# Altium schematic sheet 物联网温度实时监测设备.SchDoc
size A3
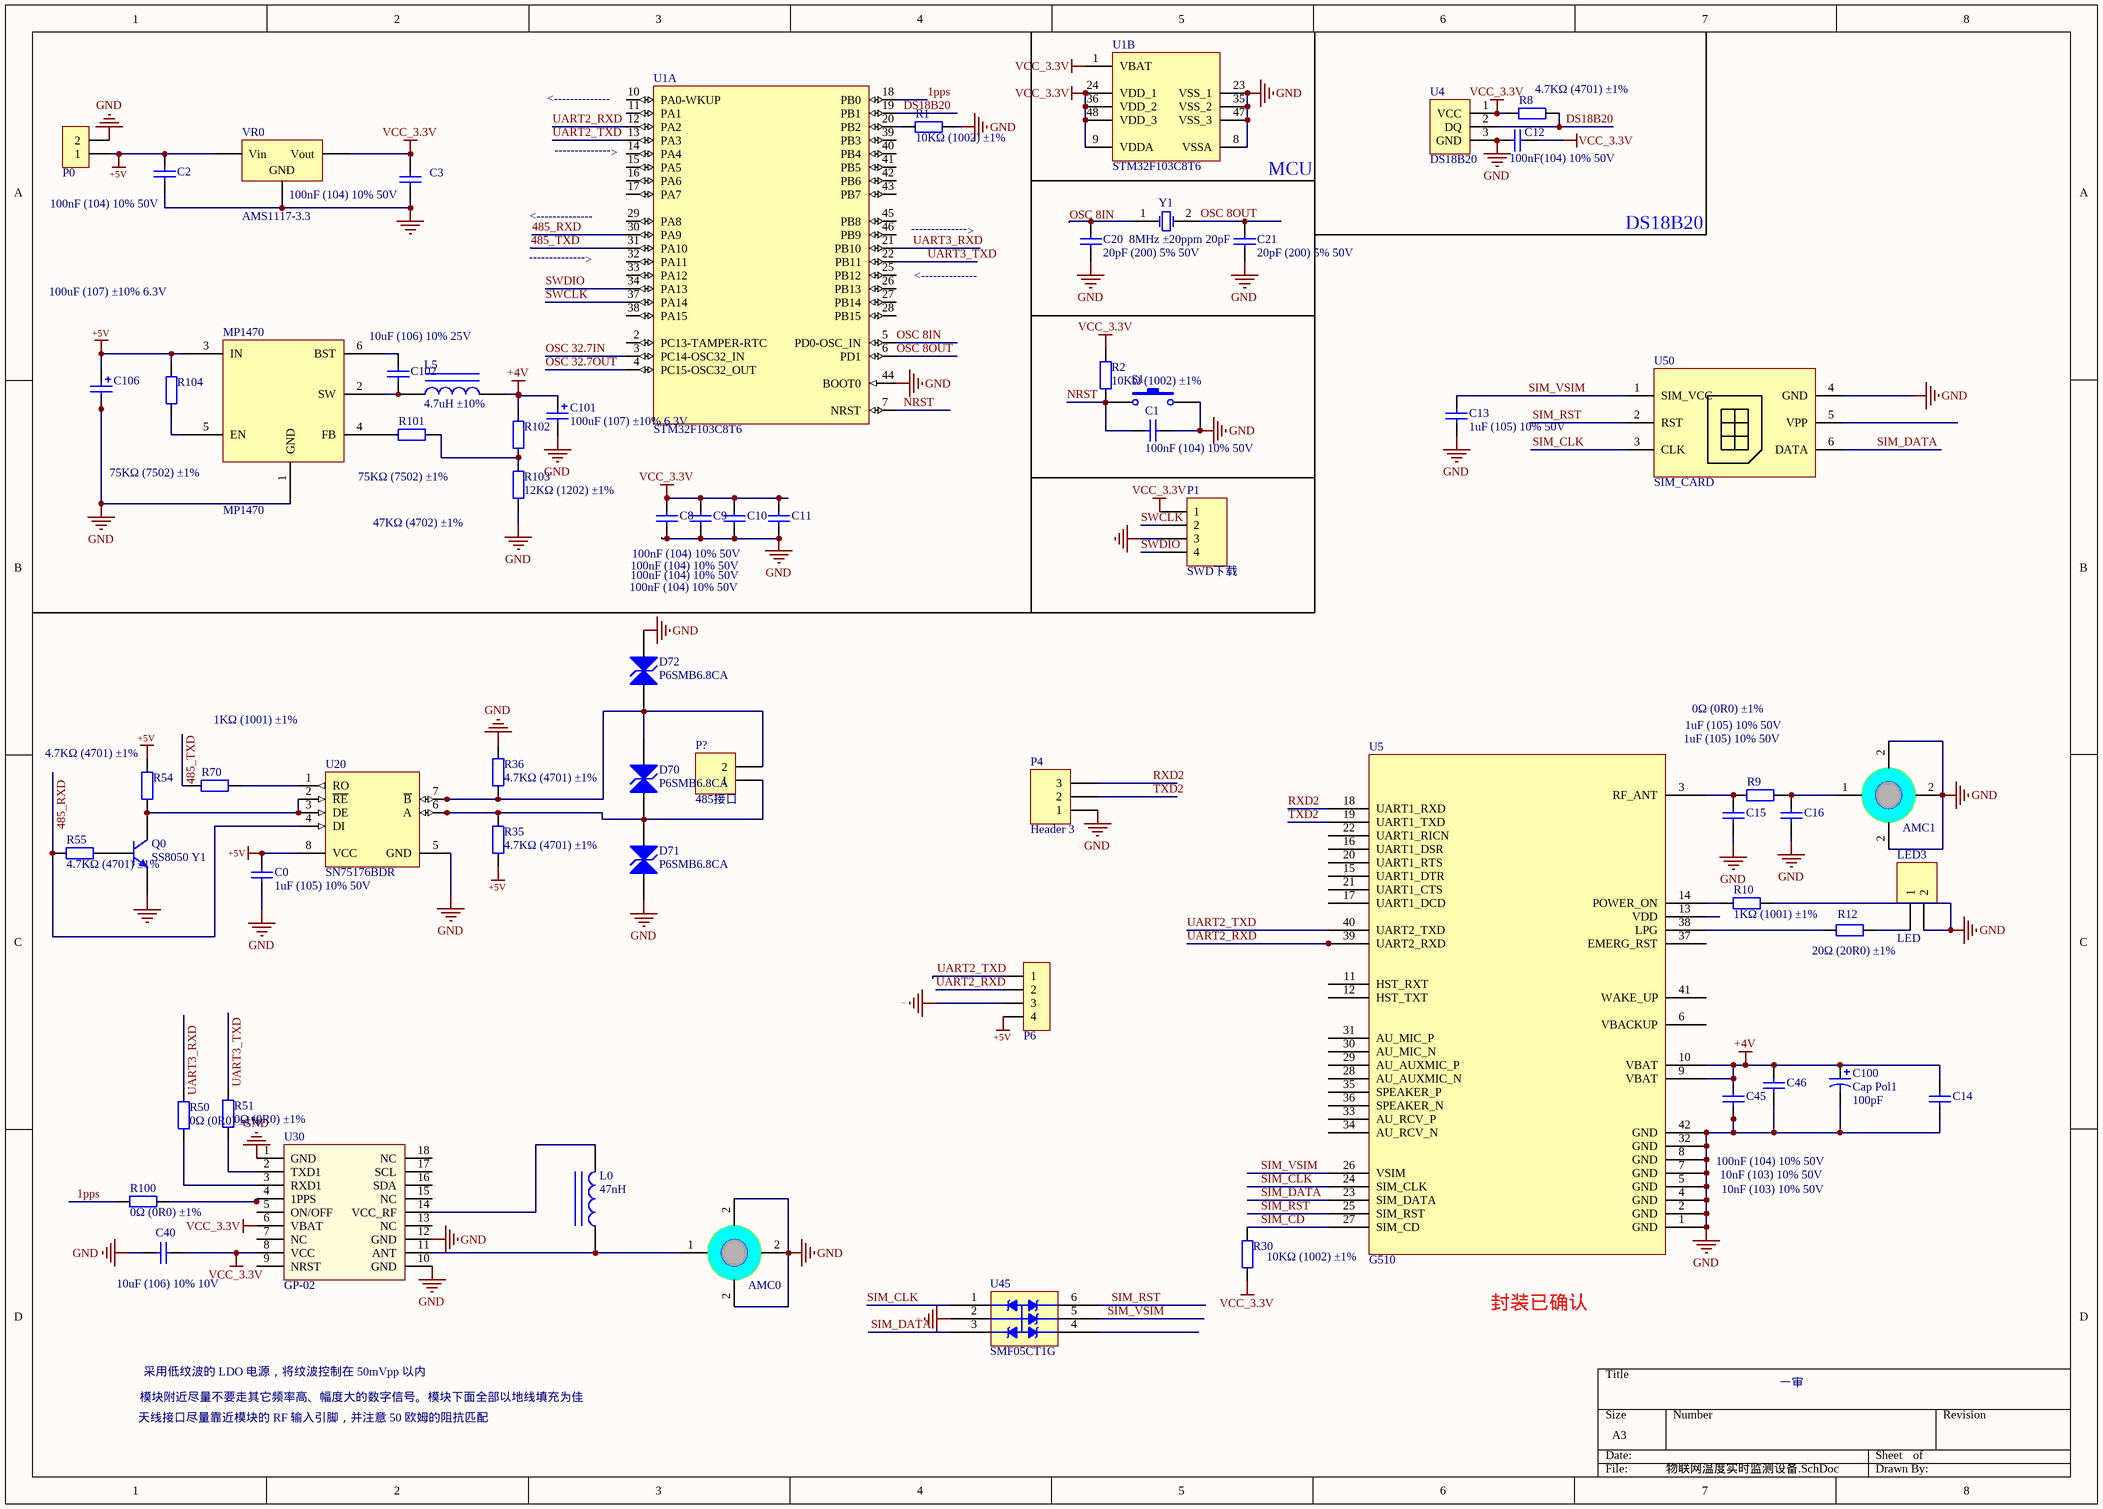
[diagram p0: 物联网温度实时监测设备.SchDoc]

## Parts
AMC0  Component_1  [IPEX]  (value not drawn)
AMC1  Component_1  [IPEX]  (value not drawn)
C0  1uF (105) 10% 50V  [0603_C]
C1  100nF (104) 10% 50V  [0603_C]
C2  100nF (104) 10% 50V  [0603_C]
C3  100nF (104) 10% 50V  [0603_C]
C8  100nF (104) 10% 50V  [0603_C]
C9  100nF (104) 10% 50V  [0603_C]
C10  100nF (104) 10% 50V  [0603_C]
C11  100nF (104) 10% 50V  [0603_C]
C12  100nF(104) 10% 50V  [CAPC_0805]
C13  1uF (105) 10% 50V  [0603_C]
C14  10nF (103) 10% 50V  [0603_C]
C15  1uF (105) 10% 50V  [0603_C]
C16  1uF (105) 10% 50V  [0603_C]
C20  20pF (200) 5% 50V  [0603_C]
C21  20pF (200) 5% 50V  [0603_C]
C40  10uF (106) 10% 10V  [0603_C]
C45  100nF (104) 10% 50V  [0603_C]
C46  10nF (103) 10% 50V  [0603_C]
C100  Cap Pol1  value 100pF  [C7361]
C101  100uF (107) ±10% 6.3V  [CASE-B_3528]
C102  10uF (106) 10% 25V  [0805_C]
C106  100uF (107) ±10% 6.3V  [CASE-B_3528]
D70  P6SMB6.8CA  [SMB(DO-214AA)_S1]
D71  P6SMB6.8CA  [SMB(DO-214AA)_S1]
D72  P6SMB6.8CA  [SMB(DO-214AA)_S1]
L0  47nH  [0603_L]
L5  4.7uH ±10%  [CD54NP]
LED3  LED  [LED_3MM]
MP1470  MP1470  [SOT-23-6M]
P0  HDR-1X2  [XH2.54-2]  (value not drawn)
P1  SWD下载  [Header 2.54X4]
P4  Header 3  [Header 2.54X3]
P6  ZH1.5-4P  [ZH1.5-4P]  (value not drawn)
P?  485接口  [2EDGK-2P]
Q0  SS8050 Y1  [SOT-23(SOT-23-3)]
R1  10KΩ (1002) ±1%  [0603_R]
R2  10KΩ (1002) ±1%  [0603_R]
R8  4.7KΩ (4701) ±1%  [0603_R]
R9  0Ω (0R0) ±1%  [0603_R]
R10  1KΩ (1001) ±1%  [0603_R]
R12  20Ω (20R0) ±1%  [0603_R]
R30  10KΩ (1002) ±1%  [0603_R]
R35  4.7KΩ (4701) ±1%  [0603_R]
R36  4.7KΩ (4701) ±1%  [0603_R]
R50  0Ω (0R0) ±1%  [0603_R]
R51  0Ω (0R0) ±1%  [0603_R]
R54  4.7KΩ (4701) ±1%  [0603_R]
R55  4.7KΩ (4701) ±1%  [0603_R]
R70  1KΩ (1001) ±1%  [0603_R]
R100  0Ω (0R0) ±1%  [0603_R]
R101  75KΩ (7502) ±1%  [0603_R]
R102  47KΩ (4702) ±1%  [0603_R]
R103  12KΩ (1202) ±1%  [0603_R]
R104  75KΩ (7502) ±1%  [0603_R]
S1  SW-PB  [KEY-SMD1]  (value not drawn)
U1  STM32F103C8T6  [LQFP_48_7X7]  (parts A,B of 2)
U4  DS18B20  [XH_2.54_3P]
U5  G510  [G510]
U20  SN75176BDR  [SOIC-8_150mil]
U30  GP-02  [GP-02]
U45  SMF05CT1G  [SC-70-6(SOT-363)]
U50  SIM_CARD  [SIM_MICRO_6P_F]
VR0  AMS1117-3.3  [SOT-223]
Y1  8MHz ±20ppm 20pF  [SMD-5032_2P]

## Nets
+4V: C14.2 C45.2 C46.2 C100.1 C101.1 L5.2 R102.2 U5.9(VBAT) U5.10(VBAT)
+5V: C0.2 C2.1 C106.1 MP1470.3(IN) P0.1 P6.4 R35.1 R54.2 R104.2 U20.8(VCC) VR0.3(Vin)
GND: AMC0.2(G) AMC1.2(G) C0.1 C1.1 C2.2 C3.1 C8.1 C9.1 C10.1 C11.1 C12.1 C13.1 C14.1 C15.1 C16.1 C20.1 C21.1 C40.2 C45.1 C46.1 C100.2 C101.2 C106.2 D71.1(A) D72.2(K) LED3.2 MP1470.1(GND) P0.2 P1.3 P4.1 P6.3 Q0.2(E) R1.2 R10.2 R36.2 R103.1 S1.2 U1.8(VSSA) U1.23(VSS_1) U1.35(VSS_2) U1.44(BOOT0) U1.47(VSS_3) U4.3(GND) U5.1(GND) U5.2(GND) U5.4(GND) U5.5(GND) U5.7(GND) U5.8(GND) U5.32(GND) U5.42(GND) U20.5(GND) U30.1(GND) U30.10(GND) U30.12(GND) U45.2 U50.4(GND) VR0.1(GND)
VCC_3.3V: C3.2 C8.2 C9.2 C10.2 C11.2 C12.2 C40.1 P1.1 R2.2 R8.1 R30.1 U1.1(VBAT) U1.9(VDDA) U1.24(VDD_1) U1.36(VDD_2) U1.48(VDD_3) U4.1(VCC) U30.6(VBAT) U30.8(VCC) VR0.2(Vout)
1pps: R100.2 U1.18(PB0)
485_RXD: R55.1 U1.30(PA9) U20.4(DI)
485_TXD: R70.1 U1.31(PA10)
DS18B20: R8.2 U1.19(PB1) U4.2(DQ)
NRST: C1.2 R2.1 S1.1 U1.7(NRST)
OSC 8IN: C20.2 U1.5(PD0-OSC_IN) Y1.1(OSC1)
OSC 8OUT: C21.2 U1.6(PD1) Y1.2(OSC2)
OSC 32.7IN: U1.3(PC14-OSC32_IN)
OSC 32.7OUT: U1.4(PC15-OSC32_OUT)
RXD2: P4.3 U5.18(UART1_RXD)
SIM_CD: R30.2 U5.27(SIM_CD)
SIM_CLK: U5.24(SIM_CLK) U45.1 U50.3(CLK)
SIM_DATA: U5.23(SIM_DATA) U45.3 U50.6(DATA)
SIM_RST: U5.25(SIM_RST) U45.6 U50.2(RST)
SIM_VSIM: C13.2 U5.26(VSIM) U45.5 U50.1(SIM_VCC)
SWCLK: P1.2 U1.37(PA14)
SWDIO: P1.4 U1.34(PA13)
TXD2: P4.2 U5.19(UART1_TXD)
UART2_RXD: P6.2 U1.12(PA2) U5.39(UART2_RXD)
UART2_TXD: P6.1 U1.13(PA3) U5.40(UART2_TXD)
UART3_RXD: R50.2 U1.21(PB10)
UART3_TXD: R51.2 U1.22(PB11)
NetAMC0_1: AMC0.1(S) L0.1 U30.11(ANT)
NetAMC1_1: AMC1.1(S) C16.2 R9.2
NetC15_2: C15.2 R9.1 U5.3(RF_ANT)
NetC102_1: C102.1 L5.1 MP1470.2(SW)
NetC102_2: C102.2 MP1470.6(BST)
NetD70_1: D70.1(A) D71.2(K) P?.1 R35.2 U20.6(A)
NetD70_2: D70.2(K) D72.1(A) P?.2 R36.1 U20.7(~{B})
NetL0_2: L0.2 U30.14(VCC_RF)
NetLED3_1: LED3.1 R12.2
NetMP1470_4: MP1470.4(FB) R101.1
NetMP1470_5: MP1470.5(EN) R104.1
NetQ0_1: Q0.1(B) R55.2
NetQ0_3: Q0.3(C) R54.1 U20.2(~{RE}) U20.3(DE)
NetR1_1: R1.1 U1.20(PB2)
NetR10_1: R10.1 U5.14(POWER_ON)
NetR12_1: R12.1 U5.38(LPG)
NetR50_1: R50.1 U30.3(RXD1)
NetR51_1: R51.1 U30.2(TXD1)
NetR70_2: R70.2 U20.1(RO)
NetR100_1: R100.1 U30.4(1PPS)
NetR101_2: R101.2 R102.1 R103.2

Not connected (* = marked no-connect by the designer): U1 2(PC13-TAMPER-RTC) 10(PA0-WKUP) 11(PA1) 14(PA4) 15(PA5) 16(PA6) 17(PA7) 25(PB12) 26(PB13) 27(PB14) 28(PB15) 29(PA8) 32(PA11) 33(PA12) 38(PA15) 39(PB3) 40(PB4) 41(PB5) 42(PB6) 43(PB7) 45(PB8) 46(PB9); U5 6(VBACKUP) 11(HST_RXT) 12(HST_TXT) 13(VDD) 15(UART1_DTR) 16(UART1_DSR) 17(UART1_DCD) 20(UART1_RTS) 21(UART1_CTS) 22(UART1_RICN) 28(AU_AUXMIC_N) 29(AU_AUXMIC_P) 30(AU_MIC_N) 31(AU_MIC_P) 33(AU_RCV_P) 34(AU_RCV_N) 35(SPEAKER_P) 36(SPEAKER_N) 37(EMERG_RST) 41(WAKE_UP); U30 5(ON/OFF) 7(NC) 9(NRST) 13(NC) 15(NC) 16(SDA) 17(SCL) 18(NC); U45 4; U50 5(VPP)

## Notes on the sheet
- (near U1) <--------------
- MCU
- <--------------
- DS18B20
- 封装已确认
- 采用低纹波的 LDO 电源，将纹波控制在 50mVpp 以内
- 一审
- 天线接口尽量靠近模块的 RF 输入引脚，并注意 50 欧姆的阻抗匹配
- 模块附近尽量不要走其它频率高、幅度大的数字信号。模块下面全部以地线填充为佳

## Library data of the parts
AMC0 AMC1 = Component_1_2
C0 C13 C15 C16 = 0603 1uF (105) 10% 50V: 贴片电容; ComponentLink1Description: 供应商链接; ComponentLink1URL: http://www.szlcsc.com/product/details_16531.html; Package: 0603; Supplier: LC; SuppliersPartNumber: C15849
C1-C3 C8-C11 C45 = 0603 100nF (104) 10% 50V: 贴片电容; ComponentLink1Description: 供应商链接; ComponentLink1URL: http://www.szlcsc.com/product/details_15331.html; Package: 0603; Supplier: LC; SuppliersPartNumber: C14663
C12 = 0805 100nF(104) 10% 50V: 贴片电容; ComponentLink1Description: 供应商链接; ComponentLink1URL: http://www.szlcsc.com/product/details_50686.html; Package: 0805; Supplier: LC; SuppliersPartNumber: C49678
C14 C46 = 0603 10nF (103) 10% 50V: 贴片电容; ComponentLink1Description: 供应商链接; ComponentLink1URL: http://www.szlcsc.com/product/details_58143.html; Package: 0603; Supplier: LC; SuppliersPartNumber: C57112
C20 C21 = 0603 20pF (200) 5% 50V: 贴片电容; ComponentLink1Description: 供应商链接; ComponentLink1URL: http://www.szlcsc.com/product/details_2000.html; Package: 0603; Supplier: LC; SuppliersPartNumber: C1648
C40 = 0603 10uF (106) 10% 10V: 贴片电容; ComponentLink1Description: 供应商链接; ComponentLink1URL: http://www.szlcsc.com/product/details_20411.html; Package: 0603; Supplier: LC; SuppliersPartNumber: C19702
C100 = Cap Pol1: Polarized Capacitor (Radial); Published: 8-Jun-2000; LatestRevisionDate: 17-Jul-2002; LatestRevisionNote: Re-released for DXP Platform.; PackageReference: RB7.6-15; Publisher: Altium Limited; PackageDescription: Polarized Capacitor (Radial); 2 Leads
C101 C106 = 3528 100uF (107) 10% 6.3V: 钽电容; ComponentLink1Description: 供应商链接; ComponentLink1URL: http://www.szlcsc.com/product/details_16815.html; Package: 3528; Supplier: LC; SuppliersPartNumber: C16133
C102 = 0805 10uF (106) 10% 25V: 贴片电容; ComponentLink1Description: 供应商链接; ComponentLink1URL: http://www.szlcsc.com/product/details_16532.html; Package: 0805; Supplier: LC; SuppliersPartNumber: C15850
D70-D72 = SMB/DO-214AA P6SMB6.8CA: TVS; ComponentLink1Description: 供应商链接; ComponentLink1URL: http://www.szlcsc.com/product/details_79530.html; Package: SMB/DO-214AA; Supplier: LC; SuppliersPartNumber: C78395
L0 = 0603 47nH: 贴片电感; ComponentLink1Description: 供应商链接; ComponentLink1URL: http://www.szlcsc.com/product/details_30437.html; Package: 0603; Supplier: LC; SuppliersPartNumber: C29683
L5 = 0603 4.7uH 10%: 贴片电感; ComponentLink1Description: 供应商链接; ComponentLink1URL: http://www.szlcsc.com/product/details_1386.html; Package: 0603; Supplier: LC; SuppliersPartNumber: C1034
LED3 P? = Header 2: Header, 2-Pin; LatestRevisionDate: 17-Jul-2002; LatestRevisionNote: Re-released for DXP Platform.; Publisher: Altium Limited
P0 = Header 2: 2P接插件; 版权归属: 源创客; BOM名称: 2P接插件; 学习资源: www.ooocke.com
P1 = Header 4: Header, 4-Pin; LatestRevisionDate: 17-Jul-2002; LatestRevisionNote: Re-released for DXP Platform.; Publisher: Altium Limited
P4 = Header 3: Header, 3-Pin; LatestRevisionDate: 17-Jul-2002; LatestRevisionNote: Re-released for DXP Platform.; Publisher: Altium Limited
P6 = Header 4: 4P接插件; 版权归属: 源创客; BOM名称: 4P接插件; 学习资源: www.ooocke.com
Q0 = SOT-23 SS8050 Y1: 三极管; ComponentLink1Description: 供应商链接; ComponentLink1URL: http://www.szlcsc.com/product/details_2507.html; Package: SOT-23; Supplier: LC; SuppliersPartNumber: C2150
R1 R2 R30 = 0603 10KΩ (1002) 1%: 贴片电阻; ComponentLink1Description: 供应商链接; ComponentLink1URL: http://www.szlcsc.com/product/details_26547.html; Package: 0603; Supplier: LC; SuppliersPartNumber: C25804
R8 R35 R36 R54 R55 = 0603 4.7KΩ (4701) 1%: 贴片电阻; ComponentLink1Description: 供应商链接; ComponentLink1URL: http://www.szlcsc.com/product/details_23889.html; Package: 0603; Supplier: LC; SuppliersPartNumber: C23162
R9 R50 R51 R100 = 0603 0Ω (0R0) 1%: 贴片电阻; ComponentLink1Description: 供应商链接; ComponentLink1URL: http://www.szlcsc.com/product/details_21903.html; Package: 0603; Supplier: LC; SuppliersPartNumber: C21189
R10 R70 = 0603 1KΩ (1001) 1%: 贴片电阻; ComponentLink1Description: 供应商链接; ComponentLink1URL: http://www.szlcsc.com/product/details_21904.html; Package: 0603; Supplier: LC; SuppliersPartNumber: C21190
R12 = 0603 20Ω (20R0) 1%: 贴片电阻; ComponentLink1Description: 供应商链接; ComponentLink1URL: http://www.szlcsc.com/product/details_23677.html; Package: 0603; Supplier: LC; SuppliersPartNumber: C22950
R101 R104 = 0603 75KΩ (7502) 1%: 贴片电阻; ComponentLink1Description: 供应商链接; ComponentLink1URL: http://www.szlcsc.com/product/details_23969.html; Package: 0603; Supplier: LC; SuppliersPartNumber: C23242
R102 = 0603 47KΩ (4702) 1%: 贴片电阻; ComponentLink1Description: 供应商链接; ComponentLink1URL: http://www.szlcsc.com/product/details_26562.html; Package: 0603; Supplier: LC; SuppliersPartNumber: C25819
R103 = 0603 12KΩ (1202) 1%: 贴片电阻; ComponentLink1Description: 供应商链接; ComponentLink1URL: http://www.szlcsc.com/product/details_23517.html; Package: 0603; Supplier: LC; SuppliersPartNumber: C22790
S1 = SW-PB_1: 微动开关; Published: 24-Mar-1999; LatestRevisionDate: 17-Jul-2002; LatestRevisionNote: Re-released for DXP Platform.; PackageReference: SPST-2; Publisher: Altium Limited
U1 = STM32F103C8T6: ARM; ComponentLink1Description: 供应商链接; ComponentLink1URL: http://www.szlcsc.com/product/details_9243.html; Package: LQFP-48_7x7x05P; Supplier: LC; SuppliersPartNumber: C8734
U4 = Component_1_3
U5 = Component_1_1
U20 = SN75176BDR_[C7063]: RS-485/RS-422; ComponentLink1Description: 供应商链接; ComponentLink1URL: http://www.szlcsc.com/product/details_7535.html; Package: SOIC-8_150mil; Supplier: LC; SuppliersPartNumber: C7063
U45 = SMF05CT1G_[C15879]: TVS; ComponentLink1Description: 供应商链接; ComponentLink1URL: http://www.szlcsc.com/product/details_16561.html; Package: SC-70-6(SOT-363); Supplier: LC; SuppliersPartNumber: C15879
VR0 = SOT-223 AMS1117-3.3: 低压差线性稳压(LDO); ComponentLink1Description: 供应商链接; ComponentLink1URL: http://www.szlcsc.com/product/details_6652.html; Package: SOT-223; Supplier: LC; SuppliersPartNumber: C6186
Y1 = SMD-5032_2P 8MHz 20ppm 20pF: 贴片晶振; ComponentLink1Description: 供应商链接; ComponentLink1URL: http://www.szlcsc.com/product/details_117214.html; Package: SMD-5032_2P; Supplier: LC; SuppliersPartNumber: C115962